# Altium schematic sheet 超薄对射光电-博亿精科.SchDoc
size A2
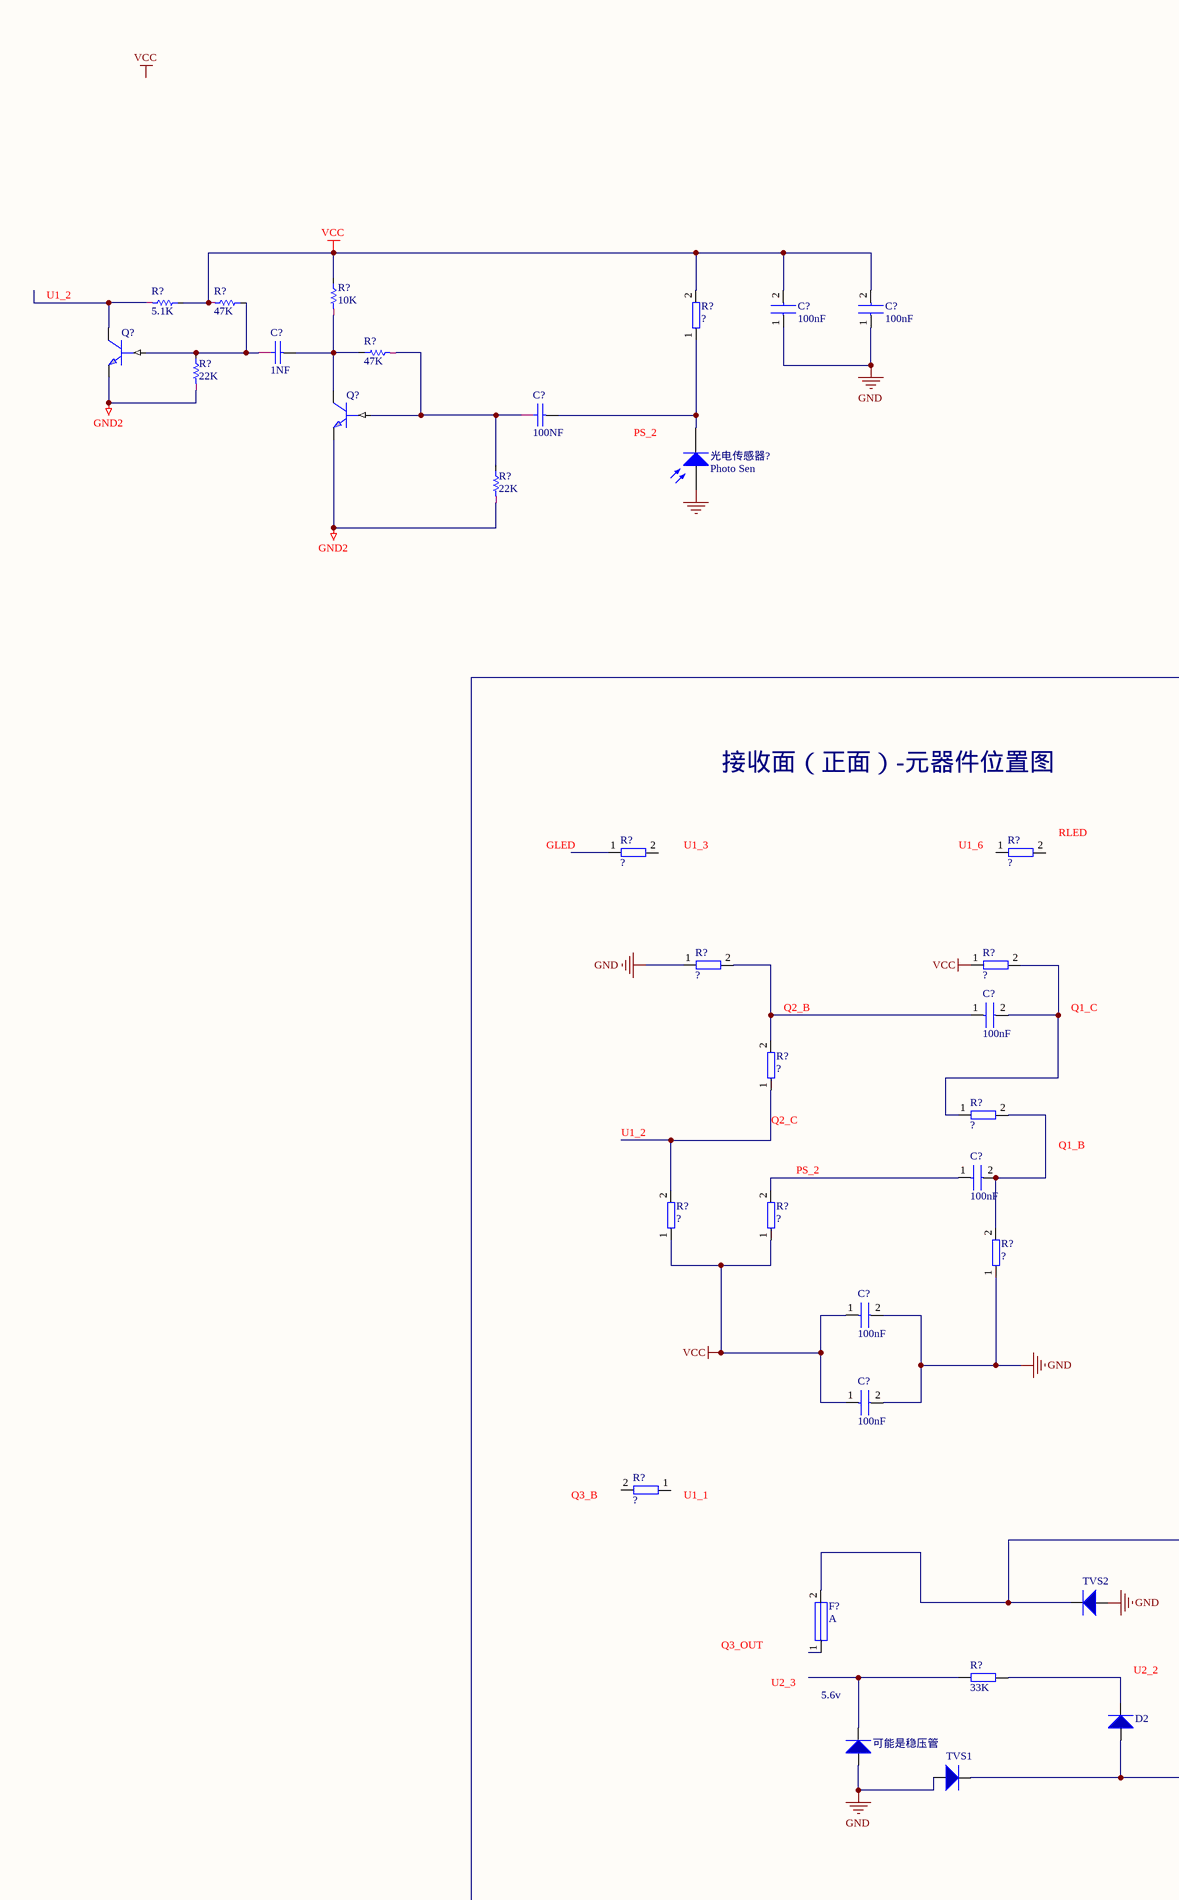
[diagram p0: 超薄对射光电-博亿精科.SchDoc, left]
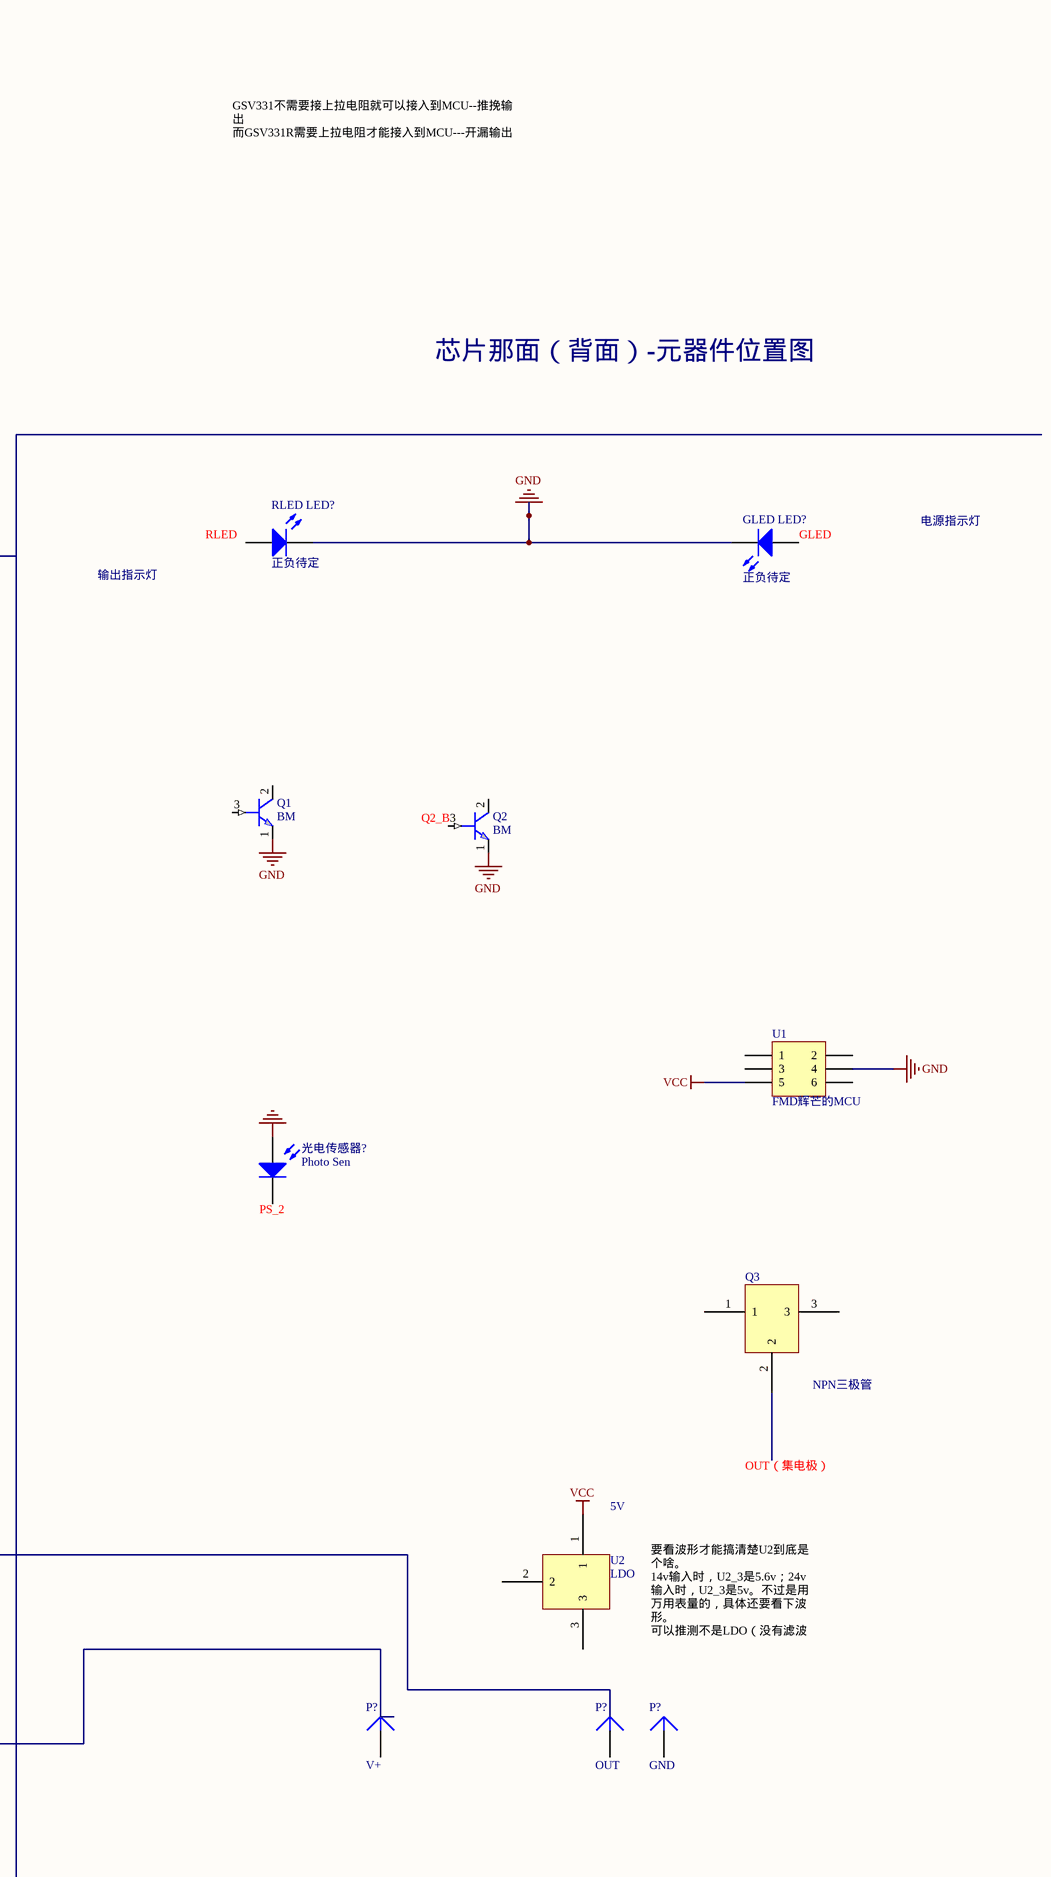
[diagram p1: 超薄对射光电-博亿精科.SchDoc, right]

## Parts
(Parts that share a designator on the sheet are numbered #1, #2 ... from top to bottom, then left to right.)
C?#1  100nF
C?#2  100nF
C?#3  1NF  [0603A]
C?#4  100NF  [0603A]
C?#5  100nF
C?#6  100nF
C?#7  100nF
C?#8  100nF
D2  (no value)
F?  A  [0603V]
GLED_LED?  正负待定  [LED-0]
P?#1  V+  [PIN1]
P?#2  OUT  [PIN1]
P?#3  GND  [PIN1]
Q1  BM  [SOT89]
Q2  BM  [SOT89]
Q3  NPN三极管
Q?#1  1AM  [SOT-23]  (value not drawn)
Q?#2  (no value)  [SOT-23]
R?#1  10K  [0603]
R?#2  5.1K  [0603]
R?#3  47K  [0603]
R?#4  47K  [0603]
R?#5  ?
R?#6  22K  [0603]
R?#7  22K  [0603]
R?#8  ?
R?#9  ?
R?#10  ?
R?#11  ?
R?#12  ?
R?#13  ?
R?#14  ?
R?#15  ?
R?#16  ?
R?#17  ?
R?#18  33K
RLED_LED?  正负待定  [LED-0]
TVS1  (no value)
TVS2  (no value)
U1  FMD辉芒的MCU  [HDR2X3]
U2  LDO
光电传感器?#1  Photo Sen  [PIN2]
光电传感器?#2  Photo Sen  [PIN2]
可能是稳压管  (no value)

## Nets
GND: C?#1.1 C?#2.1 C?#7.2 C?#8.2 GLED_LED?.2(K) Q1.1(EMITTER) Q2.1(EMITTER) R?#10.1 R?#16.1 RLED_LED?.2(K) TVS1.1 TVS2.1 U1.4 光电传感器?#1.1(A) 光电传感器?#2.1(A) 可能是稳压管.1
GND2: Q?#1.2(EMITTER) Q?#2.2(EMITTER) R?#6.2 R?#7.2
VCC: C?#1.2 C?#2.2 C?#7.1 C?#8.1 R?#1.1 R?#2.1 R?#3.2 R?#5.2 R?#11.1 R?#14.1 R?#15.1 U1.5 U2.1
NetC?#3_1: C?#3.1 Q?#2.3(COLLECTOR) R?#1.2 R?#4.1
NetC?#3_2: C?#3.2 Q?#1.1(BASE) R?#3.1 R?#6.1
NetC?#4_1: C?#4.1 R?#5.1 光电传感器?#1.2(K)
NetC?#4_2: C?#4.2 Q?#2.1(BASE) R?#4.2 R?#7.1
NetC?#5_1: C?#5.1 R?#10.2 R?#12.2
NetC?#5_2: C?#5.2 R?#11.2 R?#13.1
NetC?#6_1: C?#6.1 R?#15.2
NetC?#6_2: C?#6.2 R?#13.2 R?#16.2
NetD2_1: D2.1 TVS1.2
NetD2_2: D2.2 R?#18.2
NetF?_2: F?.2 TVS2.2
NetQ?#1_3: Q?#1.3(COLLECTOR) R?#2.2
NetR?#12_1: R?#12.1 R?#14.2
NetR?#18_1: R?#18.1 可能是稳压管.2

Not connected (* = marked no-connect by the designer): F? 1; GLED_LED? 1(A); P?#1 1; P?#2 1; P?#3 1; Q1 2(COLLECTOR) 3(BASE); Q2 2(COLLECTOR) 3(BASE); Q3 1 2 3; R?#8 1 2; R?#9 1 2; R?#17 1 2; RLED_LED? 1(A); U1 1 2 3 6; U2 2 3; 光电传感器?#2 2(K)

## Notes on the sheet
- U1_2
- (near 光电传感器?#1) PS_2
- GSV331不需要接上拉电阻就可以接入到MCU--推挽输出
  而GSV331R需要上拉电阻才能接入到MCU---开漏输出
- 芯片那面（背面）-元器件位置图
- (near RLED_LED?) RLED
- (near GLED_LED?) GLED
- 电源指示灯
- 输出指示灯
- 接收面（正面）-元器件位置图
- GLED
- (near R?#8) U1_3
- (near R?#9) U1_6
- (near R?#9) RLED
- (near Q2) Q2_B
- (near R?#12) Q2_B
- Q1_C
- (near R?#12) Q2_C
- (near R?#15) PS_2
- Q1_B
- (near 光电传感器?#2) PS_2
- (near R?#17) Q3_B
- (near R?#17) U1_1
- (near U2) 5V
- OUT（集电极）
- Q3_OUT
- (near F?) U2_3
- (near D2) U2_2
- 要看波形才能搞清楚U2到底是个啥。
  14v输入时，U2_3是5.6v；24v输入时，U2_3是5v。不过是用万用表量的，具体还要看下波形。
  可以推测不是LDO（没有滤波电路）
- 5.6v
- Labels drawn without touching a wire or pin: VCC

## Library data of the parts
C?#1 C?#2 C?#5-C?#8 = CAP
C?#3 C?#4 = CAP: Capacitor
D2 TVS1 TVS2 可能是稳压管 = D
F? = FUSE_0: Text Field1: 30; Text Field2: 20
GLED_LED? RLED_LED? = LED0: Typical INFRARED GaAs LED; Published: 8-Jun-2000; LatestRevisionDate: 08-Jul-2005; LatestRevisionNote: Mech Layer 1 removed.; PackageReference: LED-0; Publisher: Altium Limited; PackageDescription: LED; 2 Leads
P?#1-P?#3 = Plug: LatestRevisionDate: 17-Jul-2002; LatestRevisionNote: Re-released for DXP Platform.; Publisher: Altium Limited
Q1 Q2 = U10: Text Field1: 20; Text Field2: 20
Q3 U2 = 激光
Q?#1 Q?#2 = Q2N2369_0: Text Field1: 20; Text Field2: 20
R?#1-R?#4 R?#6 R?#7 = RAS
R?#5 R?#8-R?#18 = RES
U1 = Header 3X2: Header, 3-Pin, Dual row; LatestRevisionDate: 17-Jul-2002; LatestRevisionNote: Re-released for DXP Platform.; Publisher: Altium Limited
光电传感器?#1 光电传感器?#2 = Photo Sen: Photosensitive Diode; Published: 24-Mar-1999; LatestRevisionDate: 17-Jul-2002; LatestRevisionNote: Re-released for DXP Platform.; PackageReference: PIN2; Publisher: Altium Limited